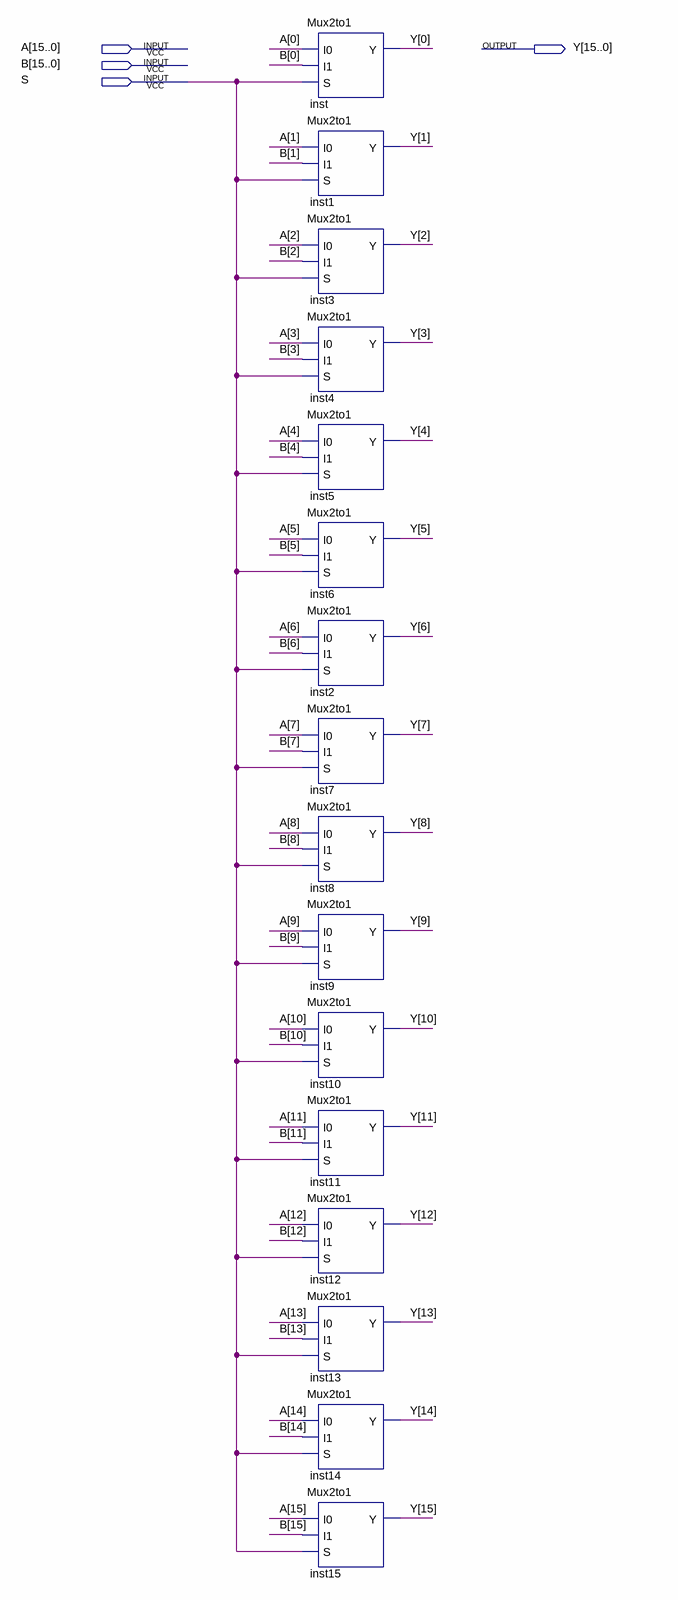
[diagram p0: schematic sheet]
// Quartus schematic Mux32to16.bdf as structural Verilog: 16 symbols, 4 pins
module Mux32to16 (
  input  [15:0] A,
  input  [15:0] B,
  input  S,
  output [15:0] Y
);

  Mux2to1 inst (.I0(A[0]), .I1(B[0]), .S(S), .Y(Y[0]));
  Mux2to1 inst1 (.I0(A[1]), .I1(B[1]), .S(S), .Y(Y[1]));
  Mux2to1 inst3 (.I0(A[2]), .I1(B[2]), .S(S), .Y(Y[2]));
  Mux2to1 inst4 (.I0(A[3]), .I1(B[3]), .S(S), .Y(Y[3]));
  Mux2to1 inst5 (.I0(A[4]), .I1(B[4]), .S(S), .Y(Y[4]));
  Mux2to1 inst6 (.I0(A[5]), .I1(B[5]), .S(S), .Y(Y[5]));
  Mux2to1 inst2 (.I0(A[6]), .I1(B[6]), .S(S), .Y(Y[6]));
  Mux2to1 inst7 (.I0(A[7]), .I1(B[7]), .S(S), .Y(Y[7]));
  Mux2to1 inst8 (.I0(A[8]), .I1(B[8]), .S(S), .Y(Y[8]));
  Mux2to1 inst9 (.I0(A[9]), .I1(B[9]), .S(S), .Y(Y[9]));
  Mux2to1 inst10 (.I0(A[10]), .I1(B[10]), .S(S), .Y(Y[10]));
  Mux2to1 inst11 (.I0(A[11]), .I1(B[11]), .S(S), .Y(Y[11]));
  Mux2to1 inst12 (.I0(A[12]), .I1(B[12]), .S(S), .Y(Y[12]));
  Mux2to1 inst13 (.I0(A[13]), .I1(B[13]), .S(S), .Y(Y[13]));
  Mux2to1 inst14 (.I0(A[14]), .I1(B[14]), .S(S), .Y(Y[14]));
  Mux2to1 inst15 (.I0(A[15]), .I1(B[15]), .S(S), .Y(Y[15]));
endmodule
